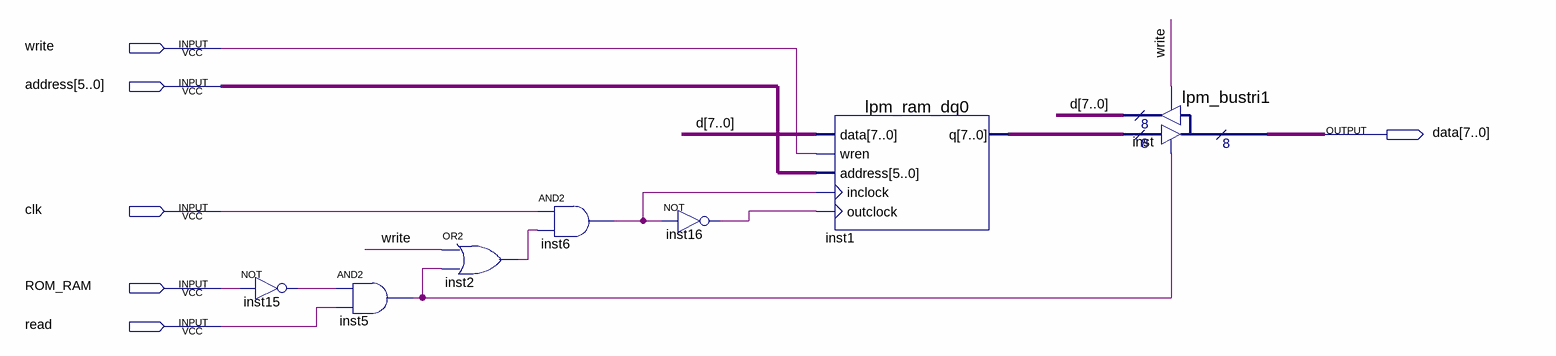
[diagram p0: schematic sheet]
// Quartus schematic lab3RAM.bdf as structural Verilog: 7 symbols, 6 pins
module lab3RAM (
  input  write,
  input  [5:0] address,
  input  clk,
  input  ROM_RAM,
  input  read,
  output [7:0] data
);

  wire inst2_out, inst5_out, inst6_out, inst15_out, inst16_out;
  wire [7:0] d, inst1_q;

  not inst15 (inst15_out, ROM_RAM);
  and inst5 (inst5_out, inst15_out, read);
  or inst2 (inst2_out, write, inst5_out);
  and inst6 (inst6_out, clk, inst2_out);
  not inst16 (inst16_out, inst6_out);
  lpm_ram_dq0 inst1 (
    .data(d), .wren(write), .address(address), .inclock(inst6_out), .outclock(inst16_out), .q(inst1_q));
  lpm_bustri1 inst (.enabledt(inst5_out), .data(inst1_q), .enabletr(write), .result(d), .tridata(data));
endmodule
